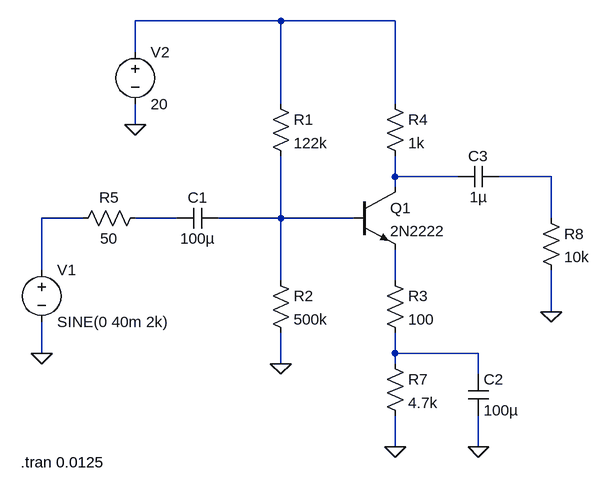
[diagram p0: schematic PrimeraEtapa-EC.asc]
PrimeraEtapa-EC.asc, the LTspice schematic file:
Version 4
SHEET 1 880 680
WIRE -64 -128 -288 -128
WIRE 112 -128 -64 -128
WIRE -288 -80 -288 -128
WIRE -64 0 -64 -128
WIRE 112 0 112 -128
WIRE -288 32 -288 0
WIRE 112 112 112 80
WIRE 208 112 112 112
WIRE 352 112 272 112
WIRE 112 128 112 112
WIRE -368 176 -432 176
WIRE -224 176 -288 176
WIRE -64 176 -64 80
WIRE -64 176 -160 176
WIRE 48 176 -64 176
WIRE 352 176 352 112
WIRE -432 256 -432 176
WIRE -64 272 -64 176
WIRE 112 272 112 224
WIRE 352 320 352 256
WIRE -432 384 -432 336
WIRE 112 384 112 352
WIRE 240 384 112 384
WIRE -64 400 -64 352
WIRE 112 400 112 384
WIRE 240 416 240 384
WIRE 112 528 112 480
WIRE 240 528 240 480
FLAG -432 384 0
FLAG -64 400 0
FLAG -288 32 0
FLAG 112 528 0
FLAG 240 528 0
FLAG 352 320 0
SYMBOL npn 48 128 R0
SYMATTR InstName Q1
SYMATTR Value 2N2222
SYMBOL res -80 -16 R0
SYMATTR InstName R1
SYMATTR Value 122k
SYMBOL res -80 256 R0
SYMATTR InstName R2
SYMATTR Value 500k
SYMBOL res 96 256 R0
SYMATTR InstName R3
SYMATTR Value 100
SYMBOL res 96 -16 R0
SYMATTR InstName R4
SYMATTR Value 1k
SYMBOL cap -160 160 R90
WINDOW 0 0 32 VBottom 2
WINDOW 3 32 32 VTop 2
SYMATTR InstName C1
SYMATTR Value 100µ
SYMBOL res -272 160 R90
WINDOW 0 0 56 VBottom 2
WINDOW 3 32 56 VTop 2
SYMATTR InstName R5
SYMATTR Value 50
SYMBOL voltage -432 240 R0
WINDOW 123 0 0 Left 0
WINDOW 39 0 0 Left 0
SYMATTR InstName V1
SYMATTR Value SINE(0 40m 2k)
SYMBOL voltage -288 -96 R0
WINDOW 123 0 0 Left 0
WINDOW 39 0 0 Left 0
SYMATTR InstName V2
SYMATTR Value 20
SYMBOL res 96 384 R0
SYMATTR InstName R7
SYMATTR Value 4.7k
SYMBOL cap 224 416 R0
SYMATTR InstName C2
SYMATTR Value 100µ
SYMBOL cap 272 96 R90
WINDOW 0 0 32 VBottom 2
WINDOW 3 32 32 VTop 2
SYMATTR InstName C3
SYMATTR Value 1µ
SYMBOL res 336 160 R0
SYMATTR InstName R8
SYMATTR Value 10k
TEXT -464 552 Left 2 !.tran 0.0125

The netlist it stands for:
* PrimeraEtapa-EC.asc
Q1 N002 N006 N007 0 2N2222
R1 N001 N006 122k
R2 N006 0 500k
R3 N007 N008 100
R4 N001 N002 1k
C1 N006 N005 100µ
R5 N005 N004 50
V1 N004 0 SINE(0 40m 2k)
V2 N001 0 20
R7 N008 0 4.7k
C2 N008 0 100µ
C3 N003 N002 1µ
R8 N003 0 10k
.model NPN NPN
.model PNP PNP
.lib standard.bjt
.tran 0.0125
.backanno
.end